# Altium schematic sheet ControllerV3.0_2.SchDoc
size A; SheetNumber: 2; SheetTotal: 2
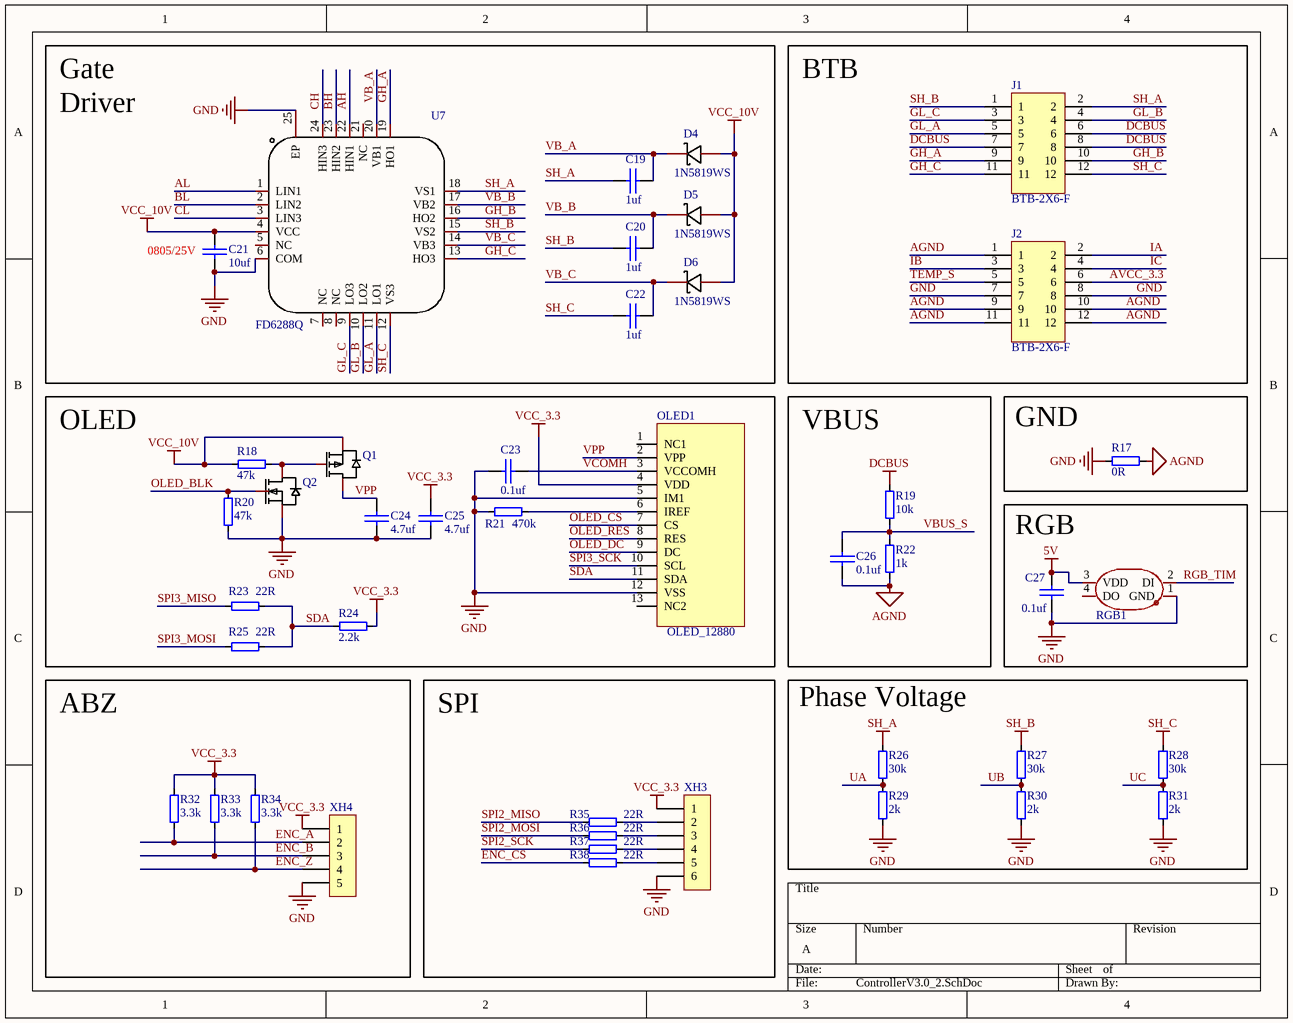
[diagram p0: ControllerV3.0_2.SchDoc]

## Parts
C19  1uf  [C0603_S]
C20  1uf  [C0603_S]
C21  10uf  [C0805_S]
C22  1uf  [C0603_S]
C23  0.1uf  [C0603_S]
C24  4.7uf  [C0603_S]
C25  4.7uf  [C0603_S]
C26  0.1uf  [C0603_S]
C27  0.1uf  [C0603_S]
D4  1N5819WS  [SOD-323]
D5  1N5819WS  [SOD-323]
D6  1N5819WS  [SOD-323]
J1  BTB-2X6-F  [BTB-F-0.8mm-2x6P]
J2  BTB-2X6-F  [BTB-F-0.8mm-2x6P]
OLED1  OLED_12880  [OLED_12880]
Q1  FDN338P  [SOT-23-3]  (value not drawn)
Q2  FDN335N  [SOT-23-3]  (value not drawn)
R17  0R  [R0603_S]
R18  47k  [R0603_S]
R19  10k  [R0603_S]
R20  47k  [R0603_S]
R21  470k  [R0603_S]
R22  1k  [R0603_S]
R23  22R  [R0603_S]
R24  2.2k  [R0603_S]
R25  22R  [R0603_S]
R26  30k  [R0603_S]
R27  30k  [R0603_S]
R28  30k  [R0603_S]
R29  2k  [R0603_S]
R30  2k  [R0603_S]
R31  2k  [R0603_S]
R32  3.3k  [R0603_S]
R33  3.3k  [R0603_S]
R34  3.3k  [R0603_S]
R35  22R  [R0603_S]
R36  22R  [R0603_S]
R37  22R  [R0603_S]
R38  22R  [R0603_S]
RGB1  XL-3528RGBW-WS2812B  [LED-SMD_4P]  (value not drawn)
U7  FD6288Q  [QFN-24-EP(4x4)]
XH3  XH2.54-WS-6P  [XH2.54-WS-6P]  (value not drawn)
XH4  XH2.54-WS-5P  [XH2.54-WS-5P]  (value not drawn)

## Blocks framed on the sheet
BTB: J1 J2
OLED: C23-C25 OLED1 Q1 Q2 R18 R20 R21 R23-R25
VBUS: C26 R19 R22
GND: R17
RGB: C27 RGB1
ABZ: R32-R34 XH4
SPI: R35-R38 XH3
Phase Voltage: R26-R31

## Nets
5V: C27.1 RGB1.3(VDD)
AGND: C26.2 J2.1 J2.9 J2.10 J2.11 J2.12 R17.1 R22.1
DCBUS: J1.6 J1.7 J1.8 R19.2
GND: C21.2 C23.1 C24.1 C25.1 C27.2 J2.7 J2.8 OLED1.5(IM1) OLED1.12(VSS) Q2.2(S) R17.2 R20.1 R21.1 R29.1 R30.1 R31.1 RGB1.1(GND) U7.6(COM) U7.25(EP) XH3.6 XH4.5
SH_A: C19.1 J1.2 R26.2 U7.18(VS1)
SH_B: C20.1 J1.1 R27.2 U7.15(VS2)
SH_C: C22.1 J1.12 R28.2 U7.12(VS3)
VCC_3.3: C25.2 OLED1.4(VDD) R24.1 R32.2 R33.2 R34.2 XH3.1 XH4.1
VCC_10V: C21.1 D4.2(A) D5.2(A) D6.2(A) Q1.2(S) R18.2 U7.4(VCC)
AH: U7.22(HIN1)
AL: U7.1(LIN1)
AVCC_3.3: J2.6
BH: U7.23(HIN2)
BL: U7.2(LIN2)
CH: U7.24(HIN3)
CL: U7.3(LIN3)
ENC_A: R32.1 XH4.2
ENC_B: R33.1 XH4.3
ENC_CS: R38.1
ENC_Z: R34.1 XH4.4
GH_A: J1.9 U7.19(HO1)
GH_B: J1.10 U7.16(HO2)
GH_C: J1.11 U7.13(HO3)
GL_A: J1.5 U7.11(LO1)
GL_B: J1.4 U7.10(LO2)
GL_C: J1.3 U7.9(LO3)
IA: J2.2
IB: J2.3
IC: J2.4
OLED_BLK: Q2.1(G) R20.2
OLED_CS: OLED1.7(CS)
OLED_DC: OLED1.9(DC)
OLED_RES: OLED1.8(RES)
RGB_TIM: RGB1.2(DI)
SDA: OLED1.11(SDA) R23.2 R24.2 R25.2
SPI2_MISO: R35.1
SPI2_MOSI: R36.1
SPI2_SCK: R37.1
SPI3_MISO: R23.1
SPI3_MOSI: R25.1
SPI3_SCK: OLED1.10(SCL)
TEMP_S: J2.5
UA: R26.1 R29.2
UB: R27.1 R30.2
UC: R28.1 R31.2
VB_A: C19.2 D4.1(K) U7.20(VB1)
VB_B: C20.2 D5.1(K) U7.17(VB2)
VB_C: C22.2 D6.1(K) U7.14(VB3)
VBUS_S: C26.1 R19.1 R22.2
VCOMH: C23.2 OLED1.3(VCCOMH)
VPP: C24.2 OLED1.2(VPP) Q1.3(D)
NetOLED1_6: OLED1.6(IREF) R21.2
NetQ1_1: Q1.1(G) Q2.3(D) R18.1
NetR35_2: R35.2 XH3.2
NetR36_2: R36.2 XH3.3
NetR37_2: R37.2 XH3.4
NetR38_2: R38.2 XH3.5

Not connected (* = marked no-connect by the designer): OLED1 1(NC1) 13(NC2); RGB1 4(DO); U7 5(NC) 7(NC) 8(NC) 21(NC)

## Notes on the sheet
- Gate
- Driver
- (near C21) 0805/25V

## Library data of the parts
C19-C27 = CAP: 贴片电容
D4-D6 = 1N5819WS: 肖特基二极管; Manufacturer: Hottech(合科泰); Device: 1N5819WS_C191023; Add into BOM: yes; Forward Voltage (Vf@If): 600mV@1A; Reverse Voltage (Vr): 40V; Average Rectified Current (Io): 1A; Symbol: 1N5819WS; Supplier: LCSC; Supplier Part: C191023; Manufacturer Part: 1N5819WS; JLCPCB Part Class: 基础库; LCSC Part Name: 电压:40V 电流:1A; Supplier Footprint: SOD-323; Datasheet: https://atta.szlcsc.com/upload/public/pdf/source/20220428/3CB86FD8D28D653594B4E35F9D5AEFD9.pdf; Convert to PCB: yes
J1 J2 = BTB-2X6-F: 0.8间距2x6P母座
OLED1 = OLED_12880: OLED_128*80
Q1 = FDN338P: P沟道 耐压:20V 电流:2A; Manufacturer: TECH PUBLIC(台舟); Symbol: FDN338P_C2890130; Add into BOM: yes; Device: FDN338P; LCSC Part Name: FDN338P; Supplier Part: C2890130; Manufacturer Part: FDN338P; Supplier Footprint: SOT-23; JLCPCB Part Class: 扩展库; Datasheet: https://atta.szlcsc.com/upload/public/pdf/source/20210903/7E6CB84F0F80073F6978D1021964D836.pdf; Supplier: LCSC; Convert to PCB: yes
Q2 = FDN335N: N沟道 耐压:20V 电流:1.7A; Manufacturer: TECH PUBLIC(台舟); Symbol: FDN335N_C5123904; Add into BOM: yes; Device: FDN335N_C5123904; Supplier: LCSC; Supplier Part: C5123904; Manufacturer Part: FDN335N; JLCPCB Part Class: 扩展库; LCSC Part Name: FDN335N; Supplier Footprint: SOT-23(TO-236); Datasheet: https://atta.szlcsc.com/upload/public/pdf/source/20221011/C6D62871DD587F26C6CC0F7FCE0BC659.pdf; Convert to PCB: yes
R17-R38 = RES: 贴片电阻
RGB1 = XL-3528RGBW-WS2812B: 发光颜色:RGB三色; Manufacturer: XINGLIGHT(成兴光); Add into BOM: yes; Emitted Color: RGB三色; Dominant Wavelength: 618nm~623nm；520nm~525nm；467nm~472nm; Peak Wavelength: 525nm；623nm；472nm; Forward Current: 20mA; Power Dissipation: 50mW；50mW；45mW; Viewing Angle: 120°; Mounting Sytle: 正贴; Symbol: XL-3528RGBW-WS2812B; Device: XL-3528RGBW-WS2812B; LCSC Part Name: RGB三色 正贴 幻彩; Supplier Part: C2890364; Manufacturer Part: XL-3528RGBW-WS2812B; Supplier Footprint: SMD3528-4P; JLCPCB Part Class: 扩展库; Datasheet: https://atta.szlcsc.com/upload/public/pdf/source/20221102/50F456983F591359B0D81AA557777463.pdf; Supplier: LCSC; Convert to PCB: yes; Diode Configuration: -; Operating Temperature: -25℃~+80℃
U7 = FD6288Q: Manufacturer: Fortior Tech(峰岹); Symbol: FD6288Q_C328453; Add into BOM: yes; Device: FD6288Q; Supplier: LCSC; Supplier Part: C328453; Manufacturer Part: FD6288Q; JLCPCB Part Class: Extended Part; LCSC Part Name: FD6288Q; Supplier Footprint: QFN-24-EP(4x4); Datasheet: https://atta.szlcsc.com/upload/public/pdf/source/20181108/C328453_785547738DB9FC0123219FC22539EFAD.pdf; Convert to PCB: yes